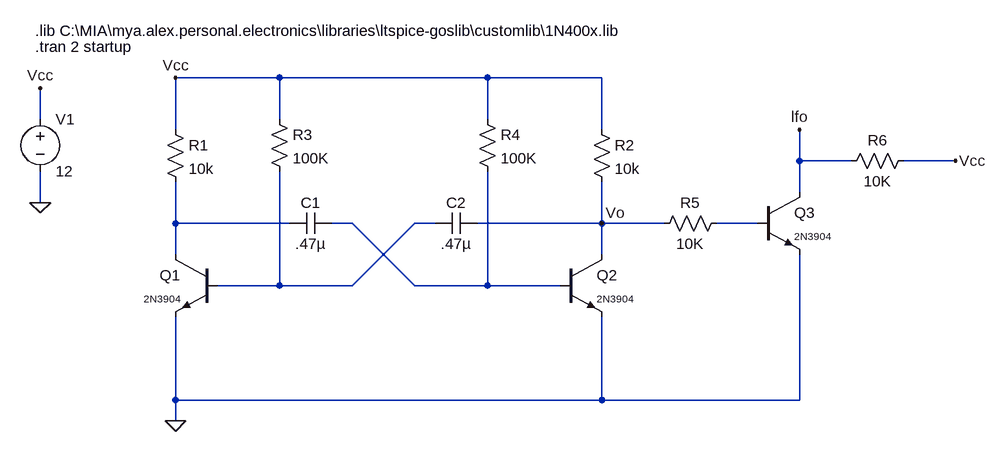
[diagram p0: schematic lfo.asc]
lfo.asc, the LTspice schematic file:
Version 4
SHEET 1 1076 740
WIRE -1424 -64 -1584 -64
WIRE -1104 -64 -1424 -64
WIRE -928 -64 -1104 -64
WIRE -1792 0 -1792 -48
WIRE -1424 0 -1424 -64
WIRE -1104 0 -1104 -64
WIRE -1584 16 -1584 -64
WIRE -928 16 -928 -64
WIRE -624 64 -624 16
WIRE -544 64 -624 64
WIRE -384 64 -464 64
WIRE -624 112 -624 64
WIRE -1792 128 -1792 80
WIRE -1584 160 -1584 96
WIRE -1408 160 -1584 160
WIRE -1312 160 -1344 160
WIRE -1184 160 -1216 160
WIRE -928 160 -928 96
WIRE -928 160 -1120 160
WIRE -832 160 -928 160
WIRE -688 160 -752 160
WIRE -1584 208 -1584 160
WIRE -928 208 -928 160
WIRE -1424 256 -1424 80
WIRE -1424 256 -1520 256
WIRE -1312 256 -1216 160
WIRE -1312 256 -1424 256
WIRE -1216 256 -1312 160
WIRE -1104 256 -1104 80
WIRE -1104 256 -1216 256
WIRE -992 256 -1104 256
WIRE -1584 432 -1584 304
WIRE -928 432 -928 304
WIRE -928 432 -1584 432
WIRE -624 432 -624 208
WIRE -624 432 -928 432
WIRE -1584 464 -1584 432
FLAG -1792 128 0
FLAG -1792 -48 Vcc
FLAG -1584 464 0
FLAG -1584 -64 Vcc
FLAG -624 16 lfo
FLAG -384 64 Vcc
FLAG -928 160 Vo
SYMBOL voltage -1792 -16 R0
WINDOW 123 0 0 Left 0
WINDOW 39 0 0 Left 0
SYMATTR InstName V1
SYMATTR Value 12
SYMBOL npn -688 112 R0
WINDOW 3 56 68 Left 1
SYMATTR Value 2N3904
SYMATTR InstName Q3
SYMBOL res -1600 0 R0
SYMATTR InstName R1
SYMATTR Value 10k
SYMBOL npn -1520 208 M0
WINDOW 3 56 68 Left 1
SYMATTR Value 2N3904
SYMATTR InstName Q1
SYMBOL npn -992 208 R0
WINDOW 3 56 68 Left 1
SYMATTR Value 2N3904
SYMATTR InstName Q2
SYMBOL res -1440 -16 R0
SYMATTR InstName R3
SYMATTR Value 100K
SYMBOL res -944 0 R0
SYMATTR InstName R2
SYMATTR Value 10k
SYMBOL res -1120 -16 R0
SYMATTR InstName R4
SYMATTR Value 100K
SYMBOL cap -1344 144 R90
WINDOW 0 0 32 VBottom 2
WINDOW 3 32 32 VTop 2
SYMATTR InstName C1
SYMATTR Value .47µ
SYMBOL cap -1120 144 R90
WINDOW 0 0 32 VBottom 2
WINDOW 3 32 32 VTop 2
SYMATTR InstName C2
SYMATTR Value .47µ
SYMBOL res -736 144 R90
WINDOW 0 0 56 VBottom 2
WINDOW 3 32 56 VTop 2
SYMATTR InstName R5
SYMATTR Value 10K
SYMBOL res -448 48 R90
WINDOW 0 0 56 VBottom 2
WINDOW 3 32 56 VTop 2
SYMATTR InstName R6
SYMATTR Value 10K
TEXT -1800 -112 Left 2 !.tran 2 startup
TEXT -1800 -136 Left 2 !.lib C:\\MIA\\mya.alex.personal.electronics\\libraries\\ltspice-goslib\\customlib\\1N400x.lib

The netlist it stands for:
* lfo.asc
V1 Vcc 0 12
Q3 lfo N004 0 0 2N3904
R1 Vcc N001 10k
Q1 N001 N003 0 0 2N3904
Q2 Vo N002 0 0 2N3904
R3 Vcc N003 100K
R2 Vcc Vo 10k
R4 Vcc N002 100K
C1 N002 N001 .47µ
C2 Vo N003 .47µ
R5 N004 Vo 10K
R6 Vcc lfo 10K
.model NPN NPN
.model PNP PNP
.lib standard.bjt
.tran 2 startup
.lib C:\MIA\mya.alex.personal.electronics\libraries\ltspice-goslib\customlib\1N400x.lib
.backanno
.end